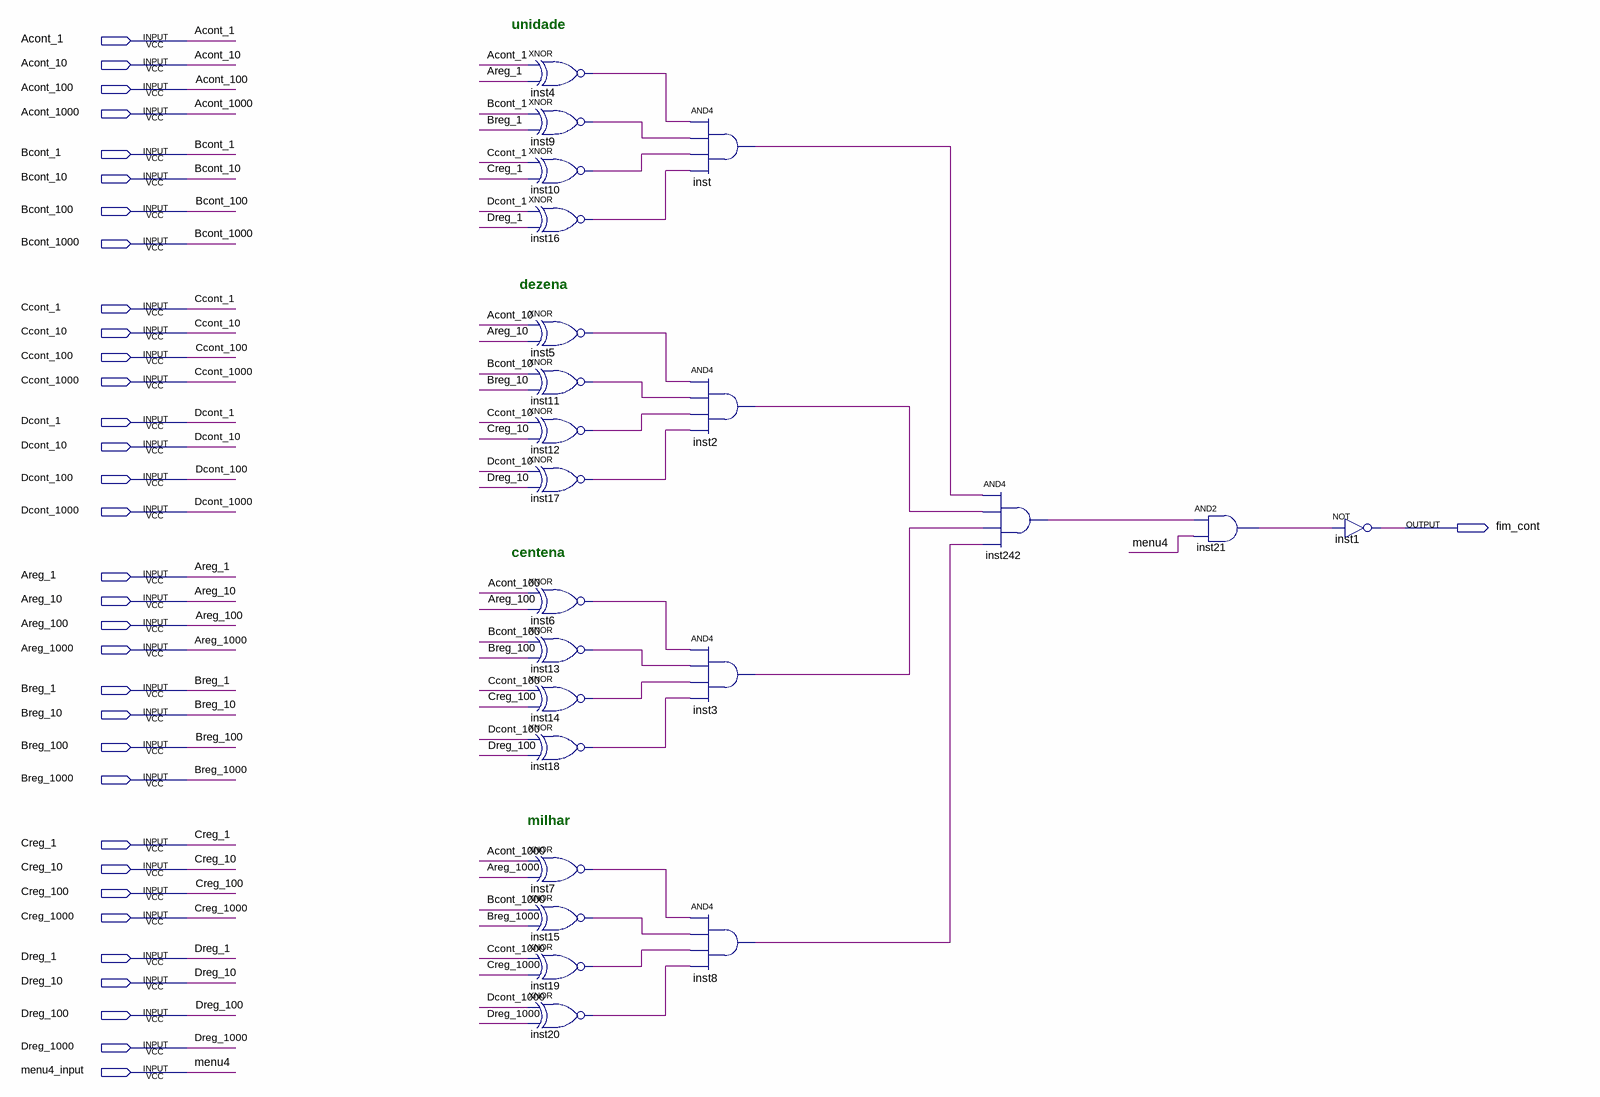
[diagram p0: schematic sheet]
// Quartus schematic Comparador.bdf as structural Verilog: 23 symbols, 34 pins
module Comparador (
  input  Acont_1,
  input  Acont_10,
  input  Acont_100,
  input  Acont_1000,
  input  Bcont_1,
  input  Bcont_10,
  input  Bcont_100,
  input  Bcont_1000,
  input  Ccont_1,
  input  Ccont_10,
  input  Ccont_100,
  input  Ccont_1000,
  input  Dcont_1,
  input  Dcont_10,
  input  Dcont_100,
  input  Dcont_1000,
  input  Areg_1,
  input  Areg_10,
  input  Areg_100,
  input  Areg_1000,
  input  Breg_1,
  input  Breg_10,
  input  Breg_100,
  input  Breg_1000,
  input  Creg_1,
  input  Creg_10,
  input  Creg_100,
  input  Creg_1000,
  input  Dreg_1,
  input  Dreg_10,
  input  Dreg_100,
  input  Dreg_1000,
  input  menu4_input,
  output fim_cont
);

  wire inst2_out, inst3_out, inst4_out, inst5_out, inst6_out, inst7_out, inst8_out, inst9_out, inst10_out,
       inst11_out, inst12_out, inst13_out, inst14_out, inst15_out, inst16_out, inst17_out, inst18_out,
       inst19_out, inst20_out, inst21_out, inst242_out, inst_out;

  xnor inst4 (inst4_out, Acont_1, Areg_1);
  xnor inst9 (inst9_out, Bcont_1, Breg_1);
  xnor inst10 (inst10_out, Ccont_1, Creg_1);
  xnor inst16 (inst16_out, Dcont_1, Dreg_1);
  xnor inst5 (inst5_out, Acont_10, Areg_10);
  xnor inst11 (inst11_out, Bcont_10, Breg_10);
  xnor inst12 (inst12_out, Ccont_10, Creg_10);
  xnor inst17 (inst17_out, Dcont_10, Dreg_10);
  xnor inst6 (inst6_out, Acont_100, Areg_100);
  xnor inst13 (inst13_out, Bcont_100, Breg_100);
  xnor inst14 (inst14_out, Ccont_100, Creg_100);
  xnor inst18 (inst18_out, Dcont_100, Dreg_100);
  xnor inst7 (inst7_out, Acont_1000, Areg_1000);
  xnor inst15 (inst15_out, Bcont_1000, Breg_1000);
  xnor inst19 (inst19_out, Ccont_1000, Creg_1000);
  xnor inst20 (inst20_out, Dcont_1000, Dreg_1000);
  and inst (inst_out, inst4_out, inst9_out, inst10_out, inst16_out);
  and inst2 (inst2_out, inst5_out, inst11_out, inst12_out, inst17_out);
  and inst3 (inst3_out, inst6_out, inst13_out, inst14_out, inst18_out);
  and inst8 (inst8_out, inst7_out, inst15_out, inst19_out, inst20_out);
  and inst242 (inst242_out, inst_out, inst2_out, inst3_out, inst8_out);
  and inst21 (inst21_out, inst242_out, menu4_input);
  not inst1 (fim_cont, inst21_out);

  // Other names for the same wires on the sheet: menu4 = menu4_input

  // Notes on the sheet:
  //   unidade
  //   dezena
  //   centena
  //   milhar
endmodule
